# Altium schematic sheet PowerToSer.SchDoc
size 381 x 241 mm; SheetNumber: 1; SheetTotal: 7
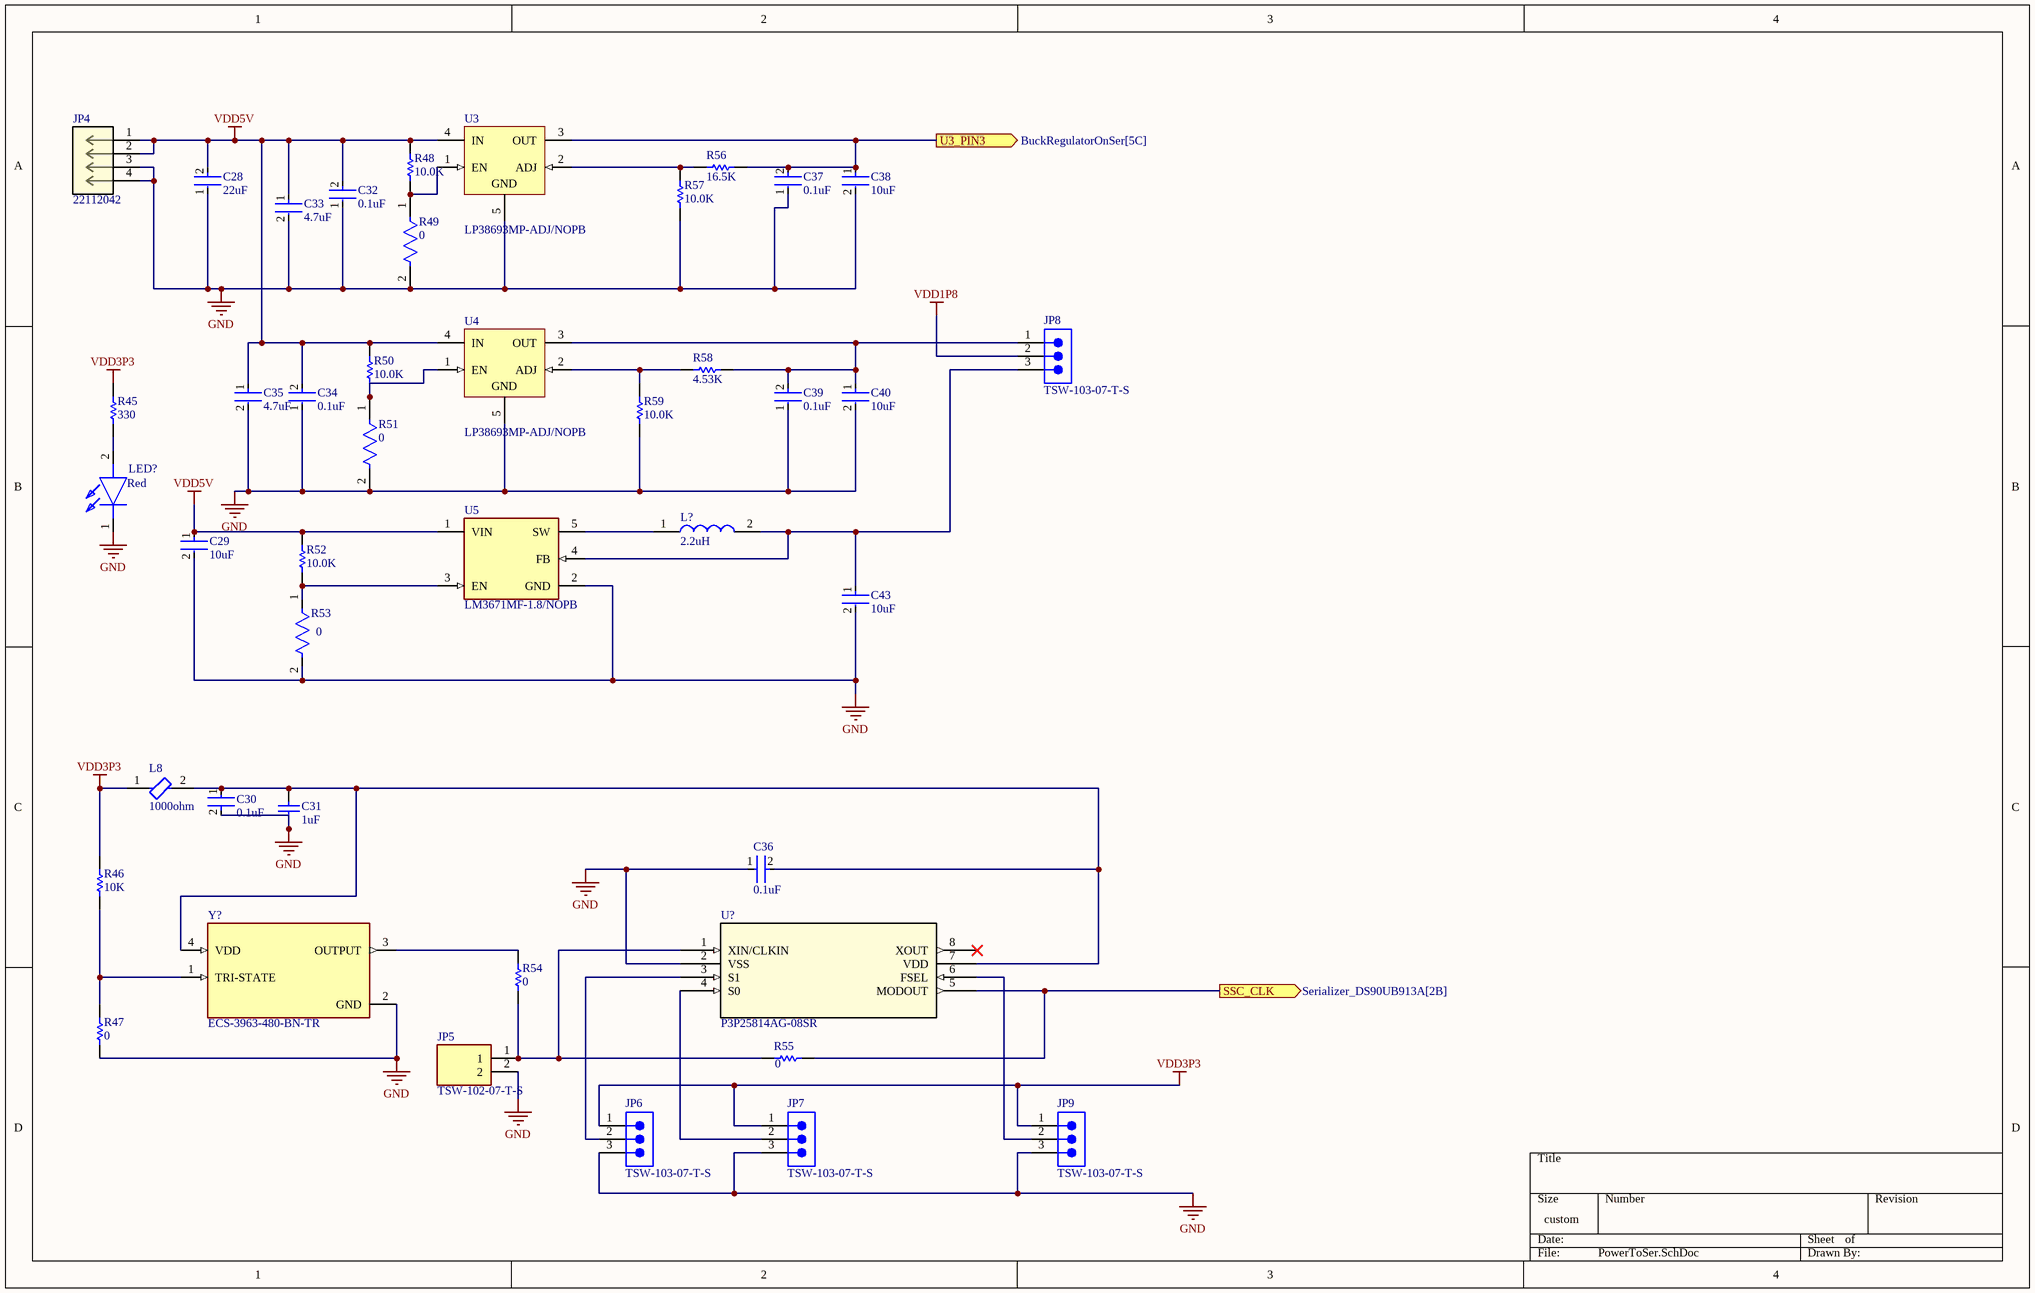
[diagram p0: PowerToSer.SchDoc]

## Parts
C28  22uF  [FP-GCM32E-0_3-IPC_B]
C29  10uF  [FP-GRM21B-0_1-IPC_C]
C30  0.1uF  [FP-GRM15-MFG]
C31  1uF  [CAPC1608X90X35ML10T15]
C32  0.1uF  [FP-GRM15-MFG]
C33  4.7uF  [FP-GRM21B-0_15-MFG]
C34  0.1uF  [FP-GRM15-MFG]
C35  4.7uF  [FP-GRM21B-0_15-MFG]
C36  0.1uF  [FP-GRM15-MFG]
C37  0.1uF  [FP-GRM15-MFG]
C38  10uF  [FP-GRM21B-0_1-IPC_C]
C39  0.1uF  [FP-GRM15-MFG]
C40  10uF  [FP-GRM21B-0_1-IPC_C]
C43  10uF  [FP-GRM21B-0_1-IPC_C]
JP4  22112042  [CONN_A-6373-04A_MOL]
JP5  TSW-102-07-T-S  [TSW-102-XX-YY-S]
JP6  TSW-103-07-T-S  [SMTC-TSW-103-07-X-S]
JP7  TSW-103-07-T-S  [SMTC-TSW-103-07-X-S]
JP8  TSW-103-07-T-S  [SMTC-TSW-103-07-X-S]
JP9  TSW-103-07-T-S  [SMTC-TSW-103-07-X-S]
L8  1000ohm  [FP-BLM18-0_15-t0_8-MFG]
L?  2.2uH  [LPS3015]
LED?  Red  [LEDC1608X55N]
R45  330  [RESC1005X40X25ML05T05]
R46  10K  [RESC1005X40X25ML05T05]
R47  0  [RESC1005X40X25LL05T05]
R48  10.0K  [RESC1609X55X30LL15T15]
R49  0  [FP-ERJ-3GEY0R00V-MFG]
R50  10.0K  [RESC1609X55X30LL15T15]
R51  0  [FP-ERJ-3GEY0R00V-MFG]
R52  10.0K  [RESC1609X55X30LL15T15]
R53  0  [FP-ERJ-3GEY0R00V-MFG]
R54  0  [RESC1005X40X25LL05T05]
R55  0  [RESC1005X40X25LL05T05]
R56  16.5K  [RESC1608X55X30LL15T15]
R57  10.0K  [RESC1609X55X30LL15T15]
R58  4.53K  [RESC1608X55X30ML15T15]
R59  10.0K  [RESC1609X55X30LL15T15]
U3  LP38693MP-ADJ/NOPB  [NDC0005A_N]
U4  LP38693MP-ADJ/NOPB  [NDC0005A_N]
U5  LM3671MF-1.8/NOPB  [FP-DBV0005A-IPC_A]
U?  P3P25814AG-08SR  [SOIC-8_NB_ONS]
Y?  ECS-3963-480-BN-TR  [OSC_ECS-3963-480-BN-TR]

## Ports
SSC_CLK (out, see Serializer_DS90UB913A[2B]), U3_PIN3 (out, see BuckRegulatorOnSer[5C])

## Nets
GND: C28.1 C29.2 C30.2 C31.2 C32.1 C33.2 C34.1 C35.2 C36.1 C37.1 C38.2 C39.1 C40.2 C43.2 JP4.3 JP4.4 JP5.2 JP6.3 JP7.3 JP9.3 LED?.1(K) R47.2 R49.2 R51.2 R53.2 R57.2 R59.2 U3.5(GND) U4.5(GND) U5.2(GND) U?.2(VSS) Y?.2(GND)
VDD1P8: JP8.2
VDD3P3: JP6.1 JP7.1 JP9.1 L8.1 R45.1 R46.1
VDD5V: C28.2 C29.1 C32.2 C33.1 C34.2 C35.1 JP4.1 JP4.2 R48.1 R50.1 R52.1 U3.4(IN) U4.4(IN) U5.1(VIN)
SSC_CLK: R55.2 U?.5(MODOUT) ; port SSC_CLK
U3_PIN3: C37.2 C38.1 R56.2 U3.3(OUT) ; port U3_PIN3
NetC30_1: C30.1 C31.1 C36.2 L8.2 U?.7(VDD) Y?.4(VDD)
NetC39_2: C39.2 C40.1 JP8.1 R58.2 U4.3(OUT)
NetC43_1: C43.1 JP8.3 L?.2 U5.4(FB)
NetJP5_1: JP5.1 R54.2 R55.1 U?.1(XIN/CLKIN)
NetJP6_2: JP6.2 U?.3(S1)
NetJP7_2: JP7.2 U?.4(S0)
NetJP9_2: JP9.2 U?.6(FSEL)
NetL?_1: L?.1 U5.5(SW)
NetLED?_2: LED?.2(A) R45.2
NetR46_2: R46.2 R47.1 Y?.1(TRI-STATE)
NetR48_2: R48.2 R49.1 U3.1(EN)
NetR50_2: R50.2 R51.1 U4.1(EN)
NetR52_2: R52.2 R53.1 U5.3(EN)
NetR54_1: R54.1 Y?.3(OUTPUT)
NetR56_1: R56.1 R57.1 U3.2(ADJ)
NetR58_1: R58.1 R59.1 U4.2(ADJ)

Not connected (* = marked no-connect by the designer): U? 8(XOUT)*

## Library data of the parts
C28 = CMP-06035-049658-1: Ceramic Capacitor for Automotive 22uF ±10% 16VDC X7R 1210 Embossed T/R; Voltage Rating: 16V; Max Operating Temperature: 125°C; Case/Package: 1210; Packaging: Tape and Reel; Termination: SMD/SMT; Height: 2.5mm; Voltage Rating (DC): 16V; Length: 3.2mm; Width: 0.098inch; Voltage: 16V; Depth: 2.5mm; Package Quantity: 1; Mount: Surface Mount; Min Operating Temperature: -55°C; Case Code (Metric): 3225; Case Code (Imperial): 1210; Radiation Hardening: No; Thickness: 0.106inch; Ratings: AEC-Q200; Capacitance: 22uF; Tolerance: 10%; Dielectric: X7R; Lead Free: Lead Free
C29 C38 C40 C43 = CMP-2007-03453-2: Chip Multilayer Ceramic Capacitors for General Purpose, 0805, 10uF, X5R, 15%, 10%, 16V; Radiation Hardening: No; Thickness: 0.053inch; Voltage Rating (DC): 16V; Lead Free: Lead Free; Package Quantity: 1; Width: 1.25mm; Case Code (Imperial): 0805; Depth: 1.25mm; Packaging: Tape and Reel; Dielectric: X5R; Max Operating Temperature: 85°C; Tolerance: 10%; Voltage Rating: 16V; Voltage: 16V; Capacitance: 10uF; Height: 1.25mm; Case Code (Metric): 2012; Material: Ceramic; Mount: Surface Mount; Case/Package: 0805; REACH SVHC: No SVHC; Length: 2mm; Min Operating Temperature: -55°C; Termination: SMD/SMT
C30 C32 C34 C36 C37 C39 = CMP-2100-03641-2: CAP CER 0.1UF 16V X7R 0402; Manufacturer Part Number: GRM155R71C104KA88D; Manufacturer: Murata; Standoff Height: 0mm; Tolerance: 10%; Voltage Rating: 16Vdc; Material: Ceramic; Capacitance: 0.10μF; Value: 0.10μF; RoHS: TRUE; Temperature Characteristic: X7R; Octopart: https://octopart.com/grm155r71c104ka88d-murata-196880; Digikey Description: CAP CER 0.1UF 16V X7R 0402; Device Class L3: Ceramic Capacitors; Height: 0.55mm; ComponentLink2Description: Datasheet; Temperature Range Low: -55°C; Ipc Land Pattern Name: CAPC10050X219; ComponentLink2URL: https://search.murata.co.jp/Ceramy/image/img/A01X/G101/ENG/GRM155R71H471KA01-01A.pdf; Device Class L1: Passive Components; Lead Free: yes; Category: Cap; Package: GRM15; Temperature: -55°C to +125°C; Device Class L2: Capacitors; Temperature Range High: +125°C; Mouser Description: 0402 0.1 uF 16V ±10 % Tolerance X7R SMT Multilayer Ceramic Capacitor
C31 = CMP-2006-02460-1: Manufacturer: Murata; Part Number: GRM188R71E105KA12D
C33 C35 = CMP-2007-03401-2: CAP CER 4.7UF 16V X7R 0805; Material: Ceramic; Tolerance: 10%; Case Code (Metric): 2012; Voltage Rating: 16V; RoHS Compliant: Yes; Voltage Rating (DC): 16V; Case/Package: 0805; Number of Pins: 2; Thickness: 0.053inch; Voltage: 16V; Mount: Surface Mount; Packaging: Tape and Reel; Lead Free: Lead Free; Case Code (Imperial): 0805; Series: GRM; Width: 0.049inch; Package Quantity: 1; Construction: Flat; Min Operating Temperature: -55°C; Termination: SMD/SMT; Max Operating Temperature: 125°C; Length: 2mm; Dielectric: X7R; Depth: 1.25mm; REACH SVHC: No SVHC; Height: 1.25mm; Capacitance: 4.7uF
JP4 = 22112042: KK 254 Solid Header, Vertical, with Friction Lock, 4 Circuits, Gold (Au)  Plating, Bag; Manufacturer_Name: Molex Connector Corporation; Copyright: Copyright (C) 2025 Ultra Librarian. All rights reserved.; Manufacturer_Part_Number: 22112042; RefDes: RefDes; Type: Type
JP5 = TSW-102-07-T-S: Connector; Manufacturer_Name: SAMTEC; Datasheet Link: http://suddendocs.samtec.com/prints/tsw-xxx-xx-xxx-x-xx-xxx-mkt.pdf; Manufacturer_Part_Number: TSW-102-07-T-S; Mouser Part Number: 200-TSW10207TS; Mouser Price/Stock: https://www.mouser.co.uk/ProductDetail/Samtec/TSW-102-07-T-S?qs=hzq9O0YpnZuE%252BS9CaLPVlQ%3D%3D; Arrow Part Number: TSW-102-07-T-S; Arrow Price/Stock: https://www.arrow.com/en/products/tsw-102-07-t-s/samtec?utm_currency=USD&region=nac
JP6-JP9 = CMP-1024-00332-1: 0.025" SQ Post Header, Through-hole, Vertical, -55 to 105 degC, 2.54 mm Pitch, 3-Pin, Male, RoHS; Manufacturer: Samtec; Pitch: 2.54 mm; ComponentLink1URL: http://www.samtec.com; ComponentLink3URL: http://www.samtec.com/documents/webfiles/cpdf/TSW-XXX-XX-XXX-X-XX-XXX-MKT.pdf; PartNumber: TSW-103-07-T-S; Mounting Technology: Through-hole; RoHS: True; DatasheetVersion: F-214; PackageVersion: DM, 8/1988; Temperature Range: -55 to 105 degC; ComponentLink2Description: Datasheet; ComponentLink1Description: Manufacturer URL; Orientation: Vertical; PackageReference: TSW-103-07-X-S; ComponentLink3Description: Package Specification; ComponentLink2URL: http://www.samtec.com/documents/webfiles/pdf/TSW_TH.PDF; PackageDescription: .025[0.64] SQ. Post Terminal Strip Assembly
L8 = CMP-0686-00457-3: Chip Ferrite Bead, 0603, 1000Ω @ 100MHz, 0.5Ω, 25%, 450mA; Number of Circuits: 1; Max DC Current: 400mA; Shielding: Unshielded; DC Resistance (DCR): 500mR; Material: Steel; DC Resistance-Max: 700mR; Impedance: 1kR; Case Code (Imperial): 0603; Max Current Rating: 400mA; Frequency: 100MHz; Min Operating Temperature: -55°C; Case/Package: 0603; Depth: 0.8mm; Lead Free: Lead Free; Core Material: Ferrite; Current Rating: 400mA; Resistance: 500mR; Case Code (Metric): 1608; DC Current: 400mA; Package Quantity: 1; Packaging: Tape and Reel; Width: 0.8mm; Military Standard: Not; Height: 0.8mm; Series: BLM18A; Max Operating Temperature: 125°C; Tolerance: 25%; Termination: SMD/SMT; Test Frequency: 100MHz; Number of Lines: 1; Number of Pins: 2; REACH SVHC: No SVHC; Length: 1.6mm; Radiation Hardening: No
L? = LPS3015-222MLB: Inductor; Manufacturer_Name: COILCRAFT; Datasheet Link: https://www.mouser.de/datasheet/2/597/lps3015-270734.pdf; Manufacturer_Part_Number: LPS3015-222MLB; Mouser Part Number: 994-LPS3015-222MLB; Mouser Price/Stock: https://www.mouser.co.uk/ProductDetail/Coilcraft/LPS3015-222MLB?qs=zCSbvcPd3pZ6eDikEPAG6g%3D%3D
LED? = LTST-C191KRKT: LED; Manufacturer_Name: Lite-On; Datasheet Link: http://www.mouser.com/ds/2/239/S_110_LTST-C191KRKT-539838.pdf; Height: 0.55mm; Manufacturer_Part_Number: LTST-C191KRKT; Mouser Part Number: 859-LTST-C191KRKT; Mouser Price/Stock: https://www.mouser.co.uk/ProductDetail/LITEON/LTST-C191KRKT?qs=BAIUz4Y8PJBLfOhzue0q%252BA%3D%3D; Arrow Part Number: LTST-C191KRKT; Arrow Price/Stock: https://www.arrow.com/en/products/ltst-c191krkt/lite-on-technology?utm_currency=USD&region=nac
R45 = CMP-2002-01143-1: Manufacturer: Panasonic; Part Number: ERJ2RKF3300X
R46 = CMP-2002-00433-1: Part Number: ERJ-2GEJ103X; Manufacturer: Panasonic
R47 R54 R55 = CMP-2000-07451-1: Chip Resistor, 0 Ohm, 0.1 W, -55 to 155 degC, 0402 (1005 Metric), RoHS, Tape and Reel; Manufacturer: Panasonic; Voltage Rating (DC): 50V; Temperature Coefficient: 600ppm/��C; Max Power Dissipation: 100mW; Resistance: 0mOhm; Tolerance: 5%; Number of Terminations: 2; Mount: SurfaceMount; Height: 0.35mm; Packaging: TapeandReel; Contact Plating: Tin; Manufacturer URL: http://www.panasonic.com/; Composition: ThickFilm; Max Operating Temperature: 155degC; REACH SVHC: NoSVHC; Case/Package: 0402; Package Reference: 402; Depth: 0.5mm; Package Description: 2-Pin Surface Mount Device, Body 1 x 0.5 mm; Datasheet URL: https://industrial.panasonic.com/cdbs/www-data/pdf/RDA0000/AOA0000C301.pdf; RoHSCompliant: True; Case Code (Imperial): 0402; Military Standard: Not; Min Operating Temperature: -55degC; Power Rating: 100mW; Datasheet Version: 03/2015; Length: 1mm; Case Code (Metric): 1005; Termination: SMD/SMT; Mounting Technology: SurfaceMount; Voltage Rating: 50V; Width: 0.02inch; Package Quantity: 1; Lead Free: LeadFree; Radiation Hardening: No
R48 R50 R52 R57 R59 = CMP-1012-00623-3: Chip Resistor, 10 KOhm, +/- 1%, 0.1 W, -55 to 155 degC, 0603 (1608 Metric), RoHS, Tape and Reel; Manufacturer: Panasonic; Voltage Rating: 75V; Case\/Package: 0603; Power Rating: 100mW; Resistance: 10KOhm; Temperature Coefficient: 100ppm\/degreesC; Number of Pins: 2; Package Reference: 603; Depth: 0.8mm; Mount: SurfaceMount; Package Description: 2-Pin Surface Mount Device, Body 1.6 x 0.85 mm; Datasheet Version: 02/2017; Length: 1.6mm; Lead Free: LeadFree; Height: 0.45mm; Number of Terminations: 2; Max Power Dissipation: 100mW; Min Operating Temperature: -55degC; Datasheet URL: https://industrial.panasonic.com/cdbs/www-data/pdf/RDA0000/AOA0000C304.pdf; Termination: SMD/SMT; Case Code (Metric): 1608; Case Code (Imperial): 0603; Tolerance: 1%; Max Operating Temperature: 155degC; RoHSCompliant: true; Voltage Rating (DC): 75V; Radiation Hardening: No; Packaging: TapeandReel; Composition: ThickFilm; Mounting Technology: SurfaceMount; Manufacturer URL: http://www.panasonic.com/; Width: 0.031inch; REACH SVHC: NoSVHC; Contact Plating: Tin; Military Standard: Not; Package Quantity: 1
R49 R51 R53 = CMP-2000-00700-2: RES SMD 0 OHM JUMPER 1/10W 0603; Manufacturer Part Number: ERJ-3GEY0R00V; Manufacturer: Panasonic; Tolerance: 5%; Automotive Grade: Grade 0; Voltage Rating: 75V; Value: 0Ω; Temperature Coefficient: -100/+600ppm/°C; Power Rating: 0.1W; Mouser Description: Resistor, Chip Thick Film, 0 Ohm, 0.1w, Resistor, Chip Thick Film, 0 Ohm, 0.1w, 5%; Ipc Land Pattern Name: RESC16080X45; Category: Res; Package: 0603; Temperature: -55°C to +155°C; Temperature Range Low: -55°C; Series: ERJ; Resistance: 0Ω; RoHS: TRUE; Composition: Thick Film; Octopart: https://octopart.com/erj-3gey0r00v-panasonic-55389238; Device Class L1: Passive Components; Footprint Url: https://industrial.panasonic.com/cdbs/www-data/pdf/RDA0000/DMA0000COL17.pdf; ComponentLink2Description: Datasheet; Device Class L2: Resistors; Temperature Range High: +155°C; Digikey Description: RES SMD 0 OHM JUMPER 1/10W 0603; Lead Free: Yes; Device Class L3: Chip SMD Resistors; Height: 0.55mm; ComponentLink2URL: https://industrial.panasonic.com/cdbs/www-data/pdf/RDA0000/AOA0000C301.pdf; Automotive: Yes
R56 = CMP-2000-00279-1: Manufacturer: Panasonic; Part Number: ERJ-3EKF1652V
R58 = CMP-2000-00512-1: Part Number: ERJ-3EKF4531V; Manufacturer: Panasonic
U3 U4 = CMP-0062-01809-4: 500mA Low Dropout CMOS Linear Regulators with Adjustable Output Stable with Ceramic Output Capacitors, 5-pin SOT-223, Pb-Free, 1000 Reel; Manufacturer: Texas Instruments; PackageTopMarking: XYTT*LJUB; CompType: LDO IC; PowerWise: Y; PackageReference: NDC0005A; ComponentLink1Description: Datasheet URL; RoHS: Y; PackageDescription: Moldec SOT-223, 6.50 x 3.56 x 1.6mm Body, 5 Lead, 1.5mm Pitch; ComponentLink1URL: http://www.ti.com/general/docs/lit/getliterature.tsp?genericPartNumber=LP38693-ADJ&fileType=pdf; PartNumber: LP38693MP-ADJ/NOPB; High-Reliability: Y; Code_JEDEC: TO-261-AB; Code_IPC: SOT223-5; PinCount: 5
U5 = CMP-0063-00882-4: IC REG BUCK 1.8V 600MA SOT23-5; Efficiency: 93%; Switching Frequency: 2.6MHz; Max Supply Voltage: 5.5V; Frequency: 2MHz; Output Type: Fixed; Min Output Voltage: 1.1V; Min Input Voltage: 2.7V; Synchronous Rectifier: Yes; Quiescent Current: 16uA; Number of Outputs: 1; Contact Plating: Tin; Max Output Voltage: 1.8V; Output Voltage: 1.8V; Termination: SMD/SMT; Mount: Surface Mount; Series: LM3671; Length: 2.92mm; Case/Package: SOT-23; Max Operating Temperature: 85°C; Nominal Output Voltage: 1.8V; Radiation Hardening: No; Package Quantity: 1000; Width: 1.6mm; REACH SVHC: No SVHC; Height: 1.02mm; Max Input Voltage: 5.5V; Lead Free: Lead Free; Output Current: 600mA; Packaging: Tape and Reel; Number of Pins: 5; RoHS Compliant: Yes; Min Operating Temperature: -40°C; Max Output Current: 600mA; Min Supply Voltage: 2.7V
U? = P3P25814AG-08SR: No Description Available; Manufacturer_Name: onsemi; Copyright: Copyright (C) 2025 Ultra Librarian. All rights reserved.; Manufacturer_Part_Number: P3P25814AG-08SR; RefDes: RefDes; Type: Type
Y? = ECS-3963-480-BN-TR: miniature SMD crystal controlled oscillators; Package: None; Price: None; Value: *; MP: ECS-3963-480-BN-TR; Availability: Unavailable